# EasyEDA schematic SCH_Rotator_2025-01-09.json
TITLE: Sheet_1; REV: 1.0; Date: 2020-12-04; Sheet: 1/1; Drawn By: hrast
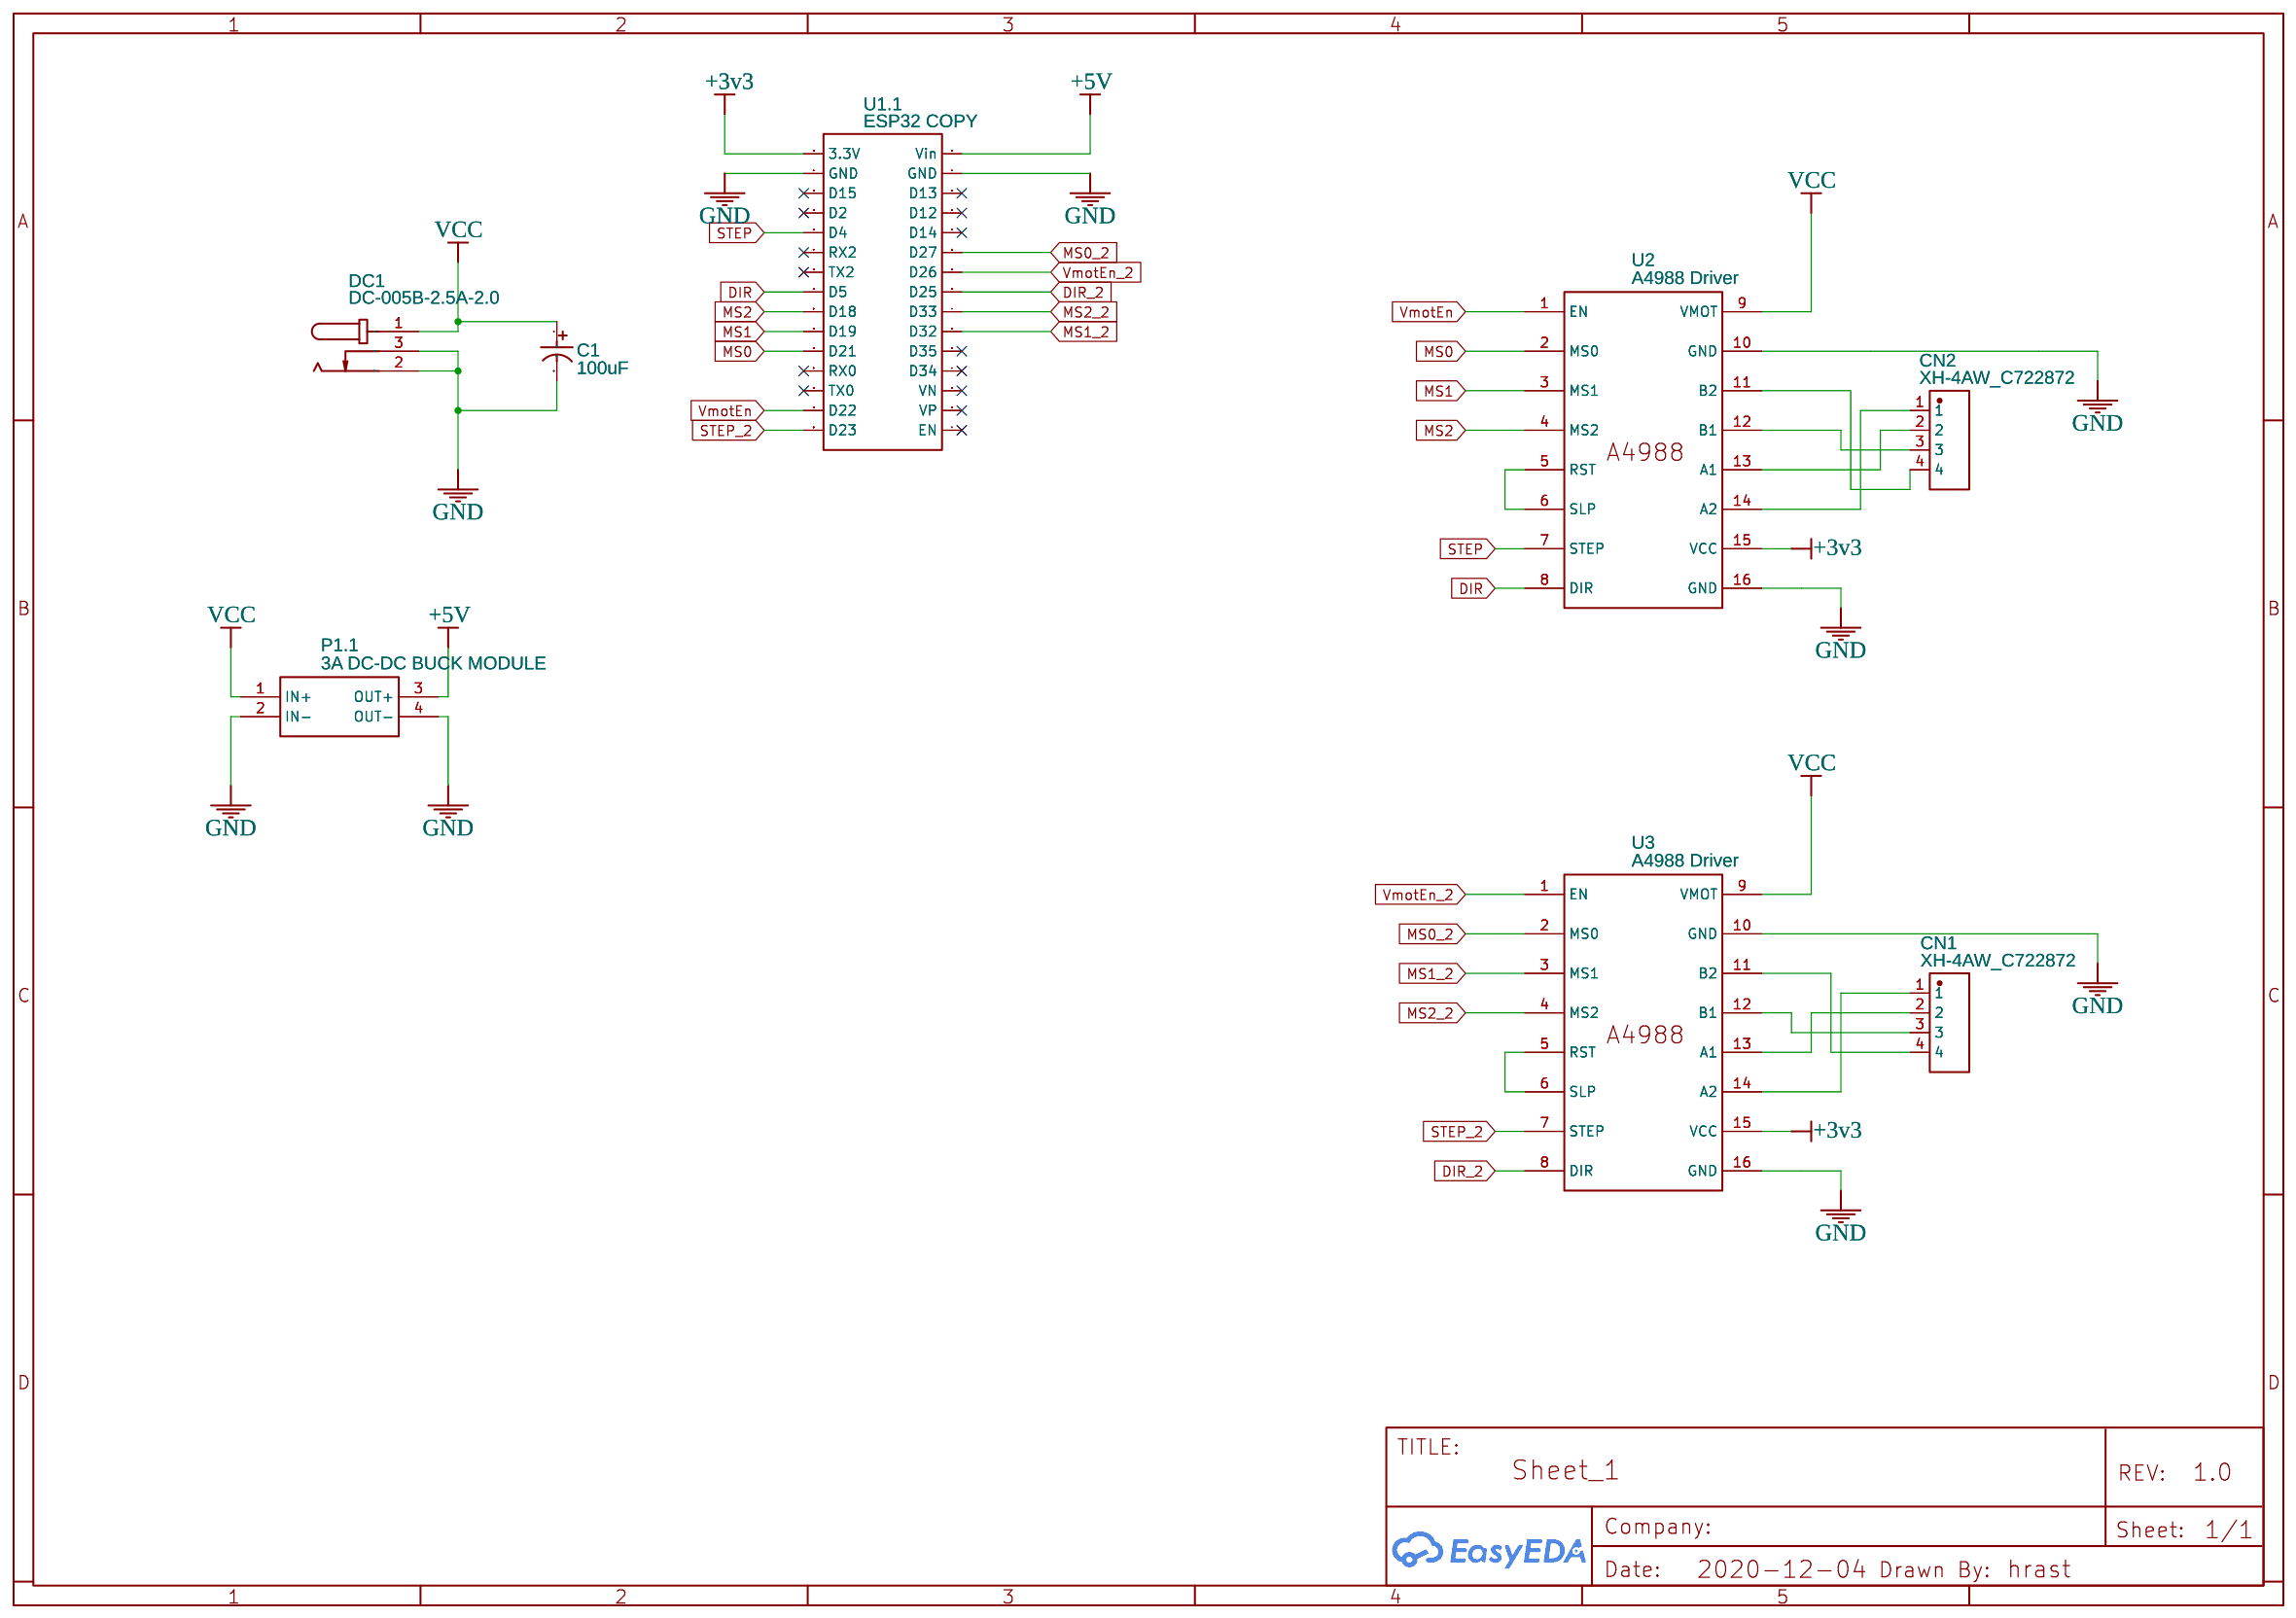
[diagram p0: schematic sheet]

## Parts
C1  100uF  [CAP-TH_BD5.0-P2.00-D0.8-FD]
CN1  XH-4AW_C722872  [CONN-TH_XH-4AW_C722872]
CN2  XH-4AW_C722872  [CONN-TH_XH-4AW_C722872]
DC1  DC-005B-2.5A-2.0  [DC-IN-TH_DC-005-20A]
P1  3A DC-DC BUCK MODULE  [3A DC-DC BUCK MODULE]  (section 1)
U1  ESP32 COPY  [ESP32 DEVELOPMENT KIT]  (section 1)
U2  A4988 Driver  [DRIVER A4988]
U3  A4988 Driver  [DRIVER A4988]

## Library data of the parts
C1 = 100uF 25V 5*11: Supplier: LCSC; Manufacturer: ValuePro; Supplier Part: C47873; JLCPCB Part Class: Extended Part
CN1 CN2 = XH-4AW_C722872: Supplier: LCSC; Supplier Part: C722872; Manufacturer: CAX; Manufacturer Part: XH-4AW; Contributor: LCSC; JLCPCB Part Class: Extended Part
DC1 = DC-005B-2.5A-2.0: Supplier: LCSC; Supplier Part: C319132; Manufacturer: XKB Enterprise; Contributor: LCSC; JLCPCB Part Class: Extended Part
P1 = 3A DC-DC BUCK MODULE: Manufacturer Part: BUCK CONVERTER; Contributor: Gavin Ferry; link: https://www.aliexpress.com/item/5-pcs-Ultra-Small-Size-DC-DC-Step-Down-Power-Supply-Module-3A-Adjustable-Step-Down/32261885063.html?spm=a2g0s.9042311.0.0.48a44c4dHCQiZa; subpart_no: 1
U1 = ESP32 COPY: Contributor: Vladislav555; subpart_no: 1
U2 U3 = A4988 Driver: Contributor: 5064871

## Nets
+3v3: U1.16(3.3V) U2.15(VCC) U3.15(VCC)
+5V: P1.3(OUT+) U1.15(Vin)
GND: C1.2 DC1.2 DC1.3 P1.2(IN-) P1.4(OUT-) U1.14(GND) U1.17(GND) U2.10(GND) U2.16(GND) U3.10(GND) U3.16(GND)
VCC: C1.1 DC1.1 P1.1(IN+) U2.9(VMOT) U3.9(VMOT)
DIR: U1.23(D5) U2.8(DIR)
DIR_2: U1.8(D25) U3.8(DIR)
MS0: U1.26(D21) U2.2(MS0)
MS0_2: U1.10(D27) U3.2(MS0)
MS1: U1.25(D19) U2.3(MS1)
MS1_2: U1.6(D32) U3.3(MS1)
MS2: U1.24(D18) U2.4(MS2)
MS2_2: U1.7(D33) U3.4(MS2)
STEP: U1.20(D4) U2.7(STEP)
STEP_2: U1.30(D23) U3.7(STEP)
VmotEn: U1.29(D22) U2.1(EN)
VmotEn_2: U1.9(D26) U3.1(EN)
Net-(CN1-1): CN1.1 U3.14(A2)
Net-(CN1-2): CN1.2 U3.13(A1)
Net-(CN1-3): CN1.3 U3.12(B1)
Net-(CN1-4): CN1.4 U3.11(B2)
Net-(CN2-1): CN2.1 U2.14(A2)
Net-(CN2-2): CN2.2 U2.13(A1)
Net-(CN2-3): CN2.3 U2.12(B1)
Net-(CN2-4): CN2.4 U2.11(B2)
Net-(U2-5): U2.5(RST) U2.6(SLP)
Net-(U3-5): U3.5(RST) U3.6(SLP)

Not connected (* = marked no-connect by the designer): U1 1(EN)* 2(VP)* 3(VN)* 4(D34)* 5(D35)* 11(D14)* 12(D12)* 13(D13)* 18(D15)* 19(D2)* 21(RX2)* 22(TX2)* 27(RX0)* 28(TX0)*
